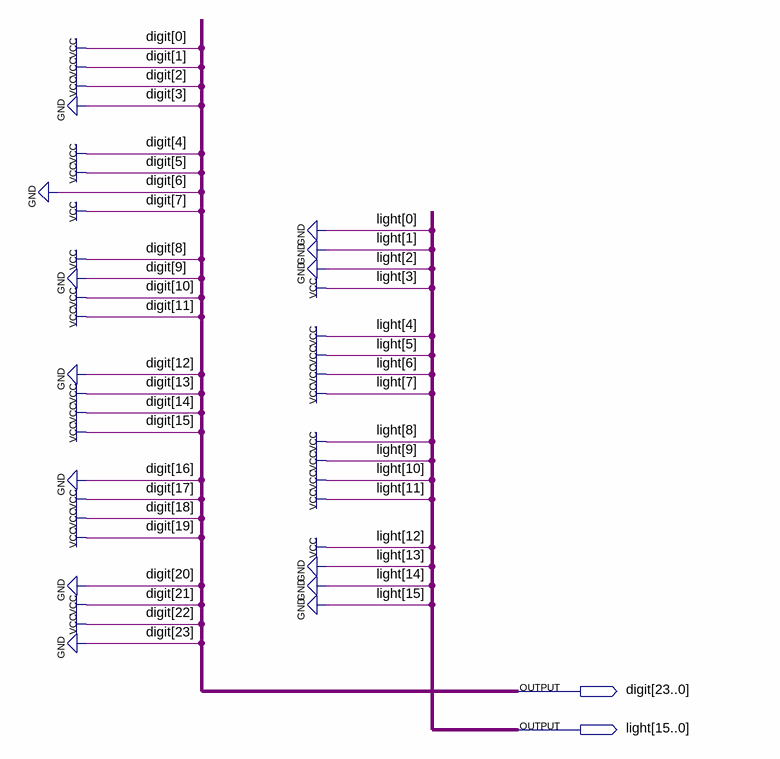
[diagram p0: schematic sheet]
// Quartus schematic Pattern_5_Frame_9.bdf as structural Verilog: 0 symbols, 2 pins
module Pattern_5_Frame_9 (
  output [23:0] digit,
  output [15:0] light
);


  assign digit = 24'b011011101110110110110111;
  assign light = 16'b0001111111111000;
endmodule
